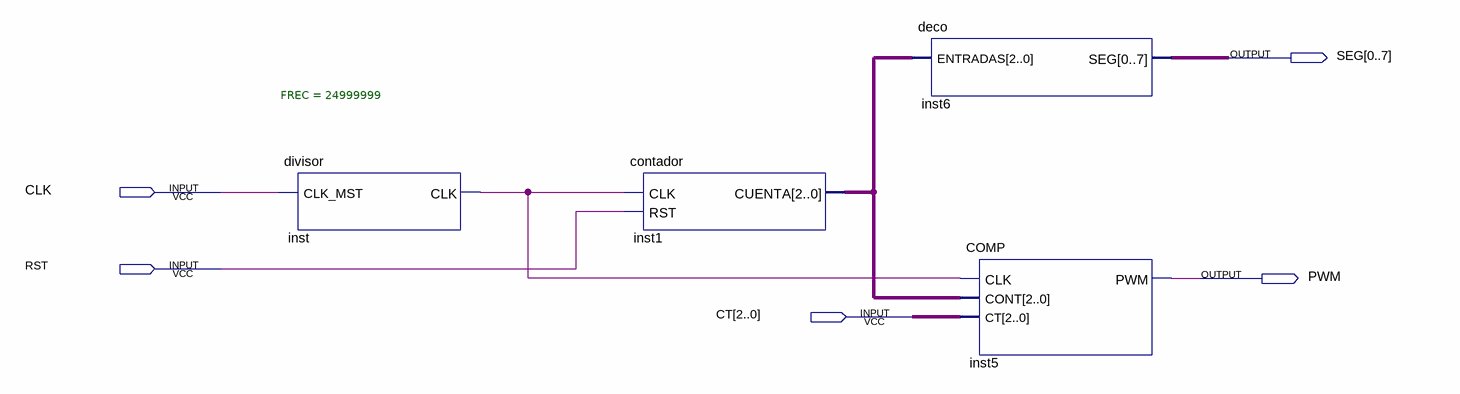
[diagram p0: schematic sheet]
// Quartus schematic main.bdf as structural Verilog: 4 symbols, 5 pins
module main (
  input  CLK,
  input  RST,
  input  [2:0] CT,
  output [0:7] SEG,
  output PWM
);

  wire inst_clk;
  wire [2:0] inst1_cuenta;

  divisor #(.FREC(24999999)) inst (.CLK_MST(CLK), .CLK(inst_clk));
  contador inst1 (.CLK(inst_clk), .RST(RST), .CUENTA(inst1_cuenta));
  deco inst6 (.ENTRADAS(inst1_cuenta), .SEG(SEG));
  COMP inst5 (.CLK(inst_clk), .CONT(inst1_cuenta), .CT(CT), .PWM(PWM));
endmodule
